# Altium schematic sheet Libaas_system.SchDoc
size A3
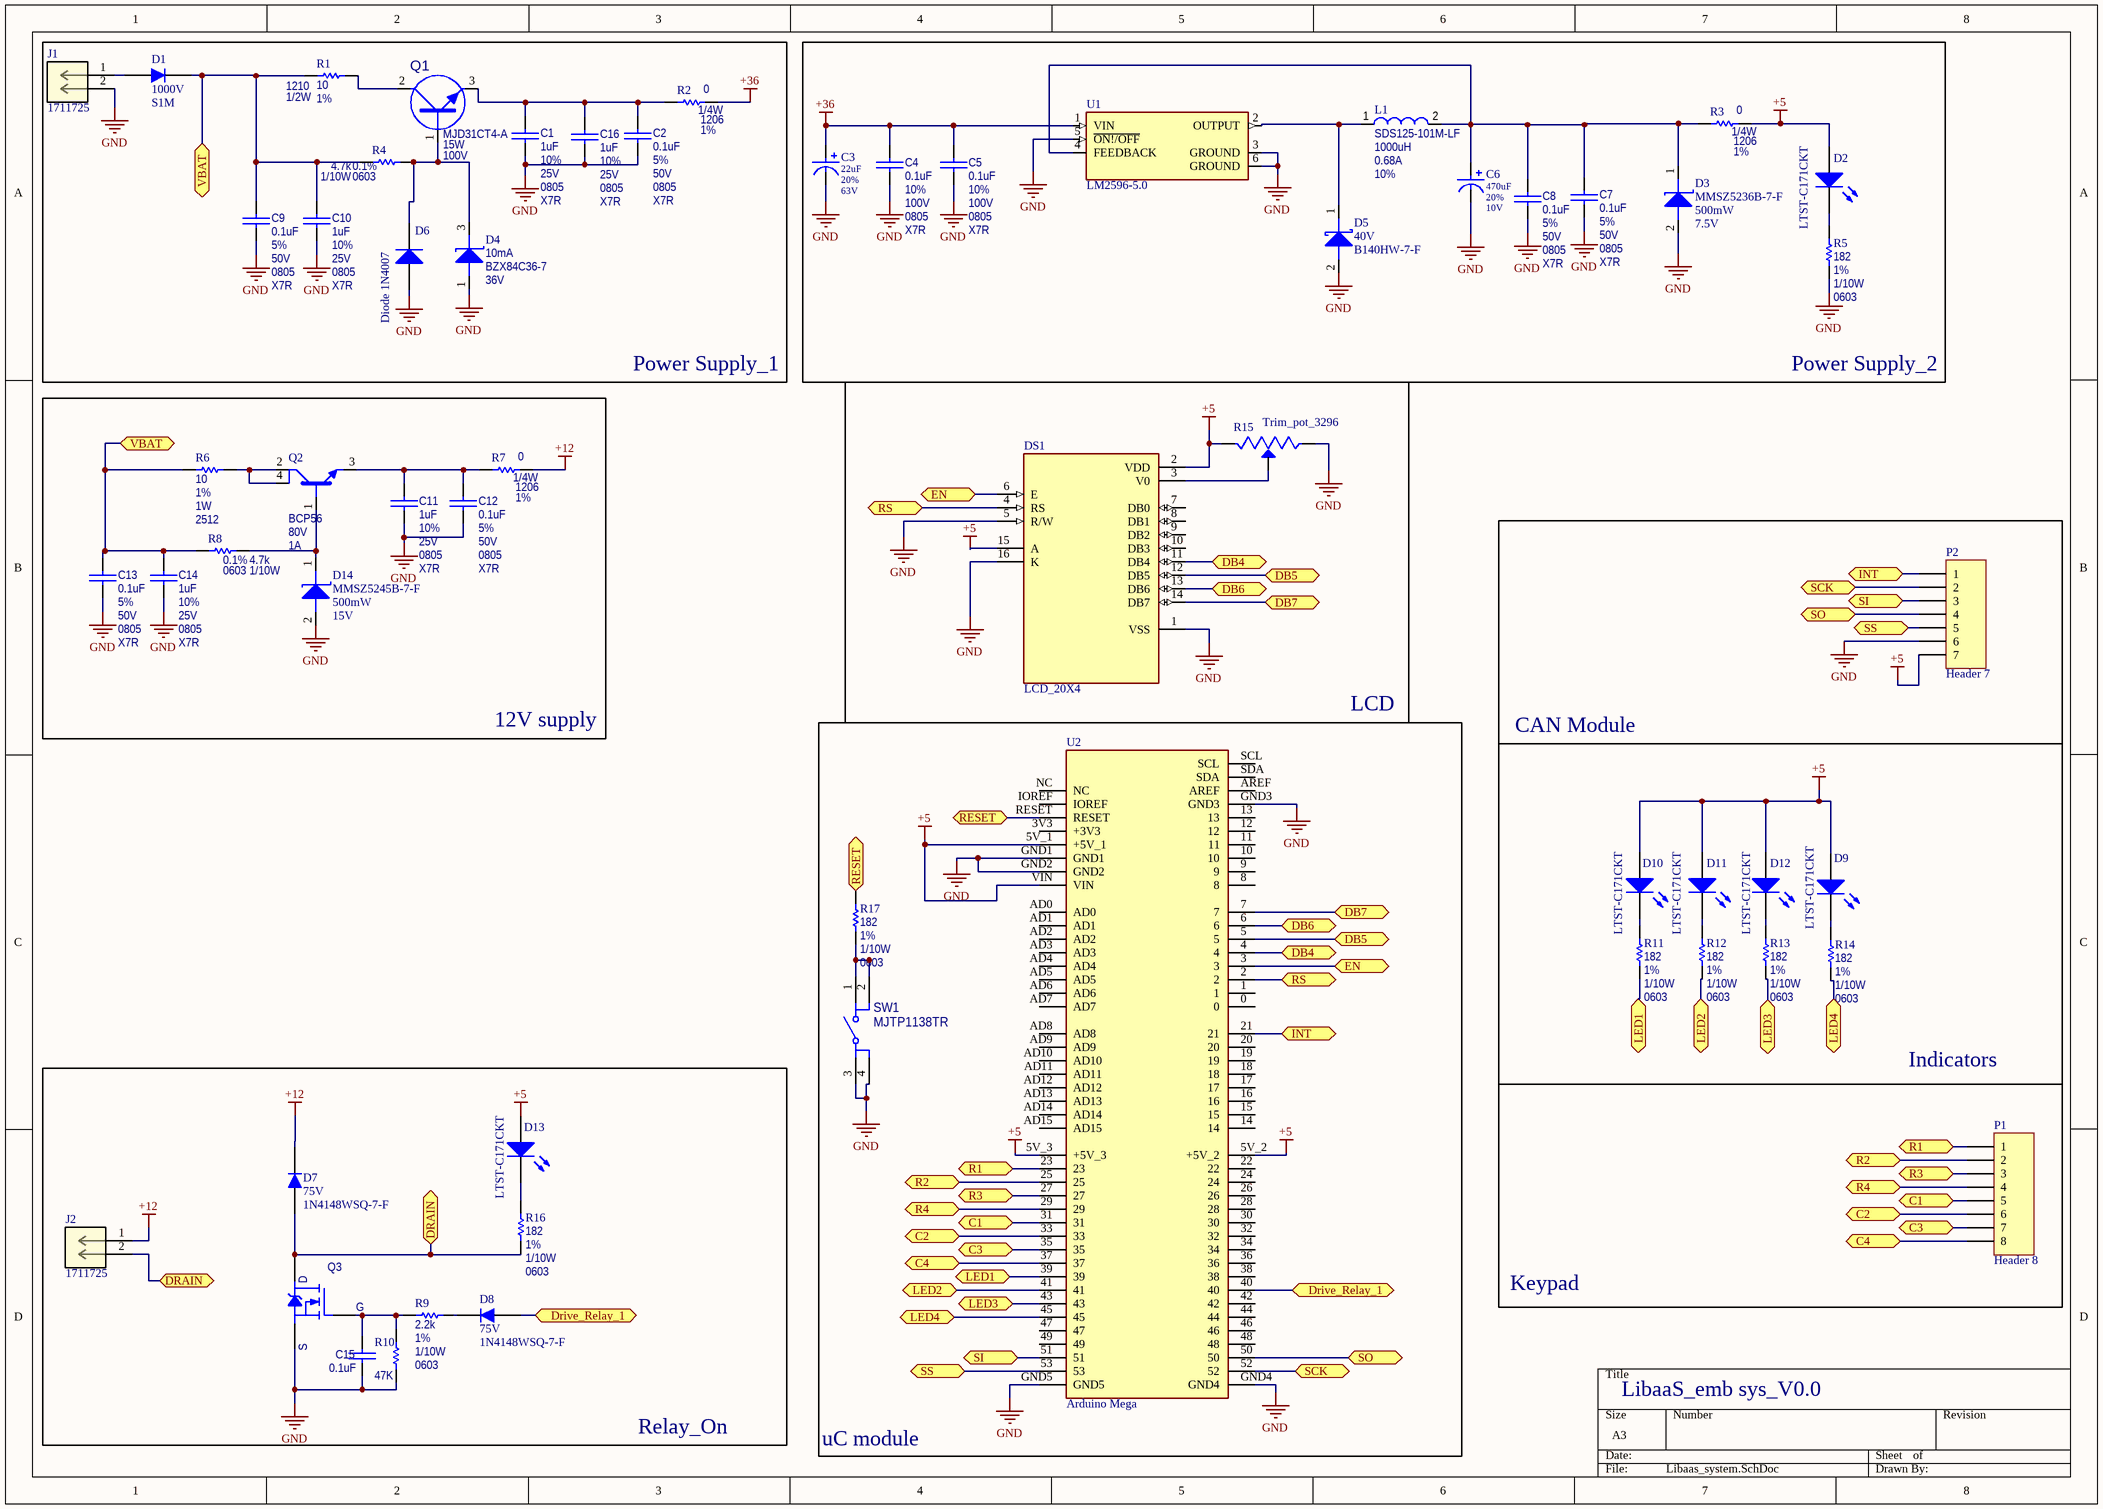
[diagram p0: Libaas_system.SchDoc]

## Parts
C1  Tolerance: 10%  Voltage: 25V  Footprint: 0805  TempCoef: X7R  [CAP0805]  (hidden comment: 1uF)
C2  Tolerance: 5%  Voltage: 50V  Footprint: 0805  TempCoef: X7R  [CAP0805]  (hidden comment: 0.1uF)
C3  Tolerance: 20%  Voltage: 63V  [CAPAE-D8_H1050]  (hidden comment: 22uF)
C4  Tolerance: 10%  Voltage: 100V  Footprint: 0805  TempCoef: X7R  [CAP0805]  (hidden comment: 0.1uF)
C5  Tolerance: 10%  Voltage: 100V  Footprint: 0805  TempCoef: X7R  [CAP0805]  (hidden comment: 0.1uF)
C6  Tolerance: 20%  Voltage: 10V  [UVZ1A471MED]  (hidden comment: 470uF)
C7  Tolerance: 5%  Voltage: 50V  Footprint: 0805  TempCoef: X7R  [CAP0805]  (hidden comment: 0.1uF)
C8  Tolerance: 5%  Voltage: 50V  Footprint: 0805  TempCoef: X7R  [CAP0805]  (hidden comment: 0.1uF)
C9  Tolerance: 5%  Voltage: 50V  Footprint: 0805  TempCoef: X7R  [CAP0805]  (hidden comment: 0.1uF)
C10  Tolerance: 10%  Voltage: 25V  Footprint: 0805  TempCoef: X7R  [CAP0805]  (hidden comment: 1uF)
C11  Tolerance: 10%  Voltage: 25V  Footprint: 0805  TempCoef: X7R  [CAP0805]  (hidden comment: 1uF)
C12  Tolerance: 5%  Voltage: 50V  Footprint: 0805  TempCoef: X7R  [CAP0805]  (hidden comment: 0.1uF)
C13  Tolerance: 5%  Voltage: 50V  Footprint: 0805  TempCoef: X7R  [CAP0805]  (hidden comment: 0.1uF)
C14  Tolerance: 10%  Voltage: 25V  Footprint: 0805  TempCoef: X7R  [CAP0805]  (hidden comment: 1uF)
C15  0.1uF  [CAP0805]
C16  Tolerance: 10%  Voltage: 25V  Footprint: 0805  TempCoef: X7R  [CAP0805]  (hidden comment: 1uF)
D1  DC Reverse Voltage  (V, Max): 1000V  Part Number: S1M  [DO-214AC]  (hidden comment: DIODE_CA)
D2  Part Number: LTST-C171CKT  [LED0805]  (hidden comment: LED)
D3  Power (W): 500mW  DC Reverse Voltage  (V, Max): 7.5V  [SOD-123]  (hidden comment: MMSZ5236B-7-F)
D4  Current at Vf (A): 10mA  Part Number: BZX84C36-7  DC Reverse Voltage  (V, Max): 36V  [SOT-23]  (hidden comment: ZENER_A_C)
D5  DC Reverse Voltage  (V, Max): 40V  Part Number: B140HW-7-F  [DO-219AD]  (hidden comment: SCHOTTKY_CA)
D6  Diode 1N4007  [DO-41]
D7  DC Reverse Voltage  (V, Max): 75V  Part Number: 1N4148WSQ-7-F  [SOD-323]  (hidden comment: DIODE_CA)
D8  DC Reverse Voltage  (V, Max): 75V  Part Number: 1N4148WSQ-7-F  [SOD-323]  (hidden comment: DIODE_CA)
D9  Part Number: LTST-C171CKT  [LED0805]  (hidden comment: LED)
D10  Part Number: LTST-C171CKT  [LED0805]  (hidden comment: LED)
D11  Part Number: LTST-C171CKT  [LED0805]  (hidden comment: LED)
D12  Part Number: LTST-C171CKT  [LED0805]  (hidden comment: LED)
D13  Part Number: LTST-C171CKT  [LED0805]  (hidden comment: LED)
D14  Power (W): 500mW  DC Reverse Voltage  (V, Max): 15V  [SOD-123]  (hidden comment: MMSZ5245B-7-F)
DS1  LCD_20X4  [HDR1X16]
J1  1711725  [1711725]
J2  1711725  [1711725]
L1  value 1000uH  Part Number: SDS125-101M-LF  Current Rating (A): 0.68A  Tolerance: 10%  [SRR1280-102K]  (hidden comment: IND)
P1  Header 8  [HDR1X8]
P2  Header 7  [HDR1X7]
Q1  Power, Max (W): 15W  Drain-Source Voltage, Vdss (V): 100V  Part Number: MJD31CT4-A  [TO-252]  (hidden comment: NPN_BCE)
Q2  Part Number: BCP56  Drain-Source Voltage, Vdss (V): 80V  Continuous Current, Id (A): 1A  [SOT-223]  (hidden comment: FZT649TA)
Q3  NMOS_GSD  [SOT-23]  (value not drawn)
R1  Tolerance: 1%  PowerRating: 1/2W  Footprint: 1210  [RES1210]  (hidden comment: 10)
R2  Tolerance: 1%  PowerRating: 1/4W  Footprint: 1206  [RES1206]  (hidden comment: 0)
R3  Tolerance: 1%  PowerRating: 1/4W  Footprint: 1206  [RES1206]  (hidden comment: 0)
R4  Tolerance: 0.1%  PowerRating: 1/10W  Footprint: 0603  [RES0603]  (hidden comment: 4.7k)
R5  Tolerance: 1%  PowerRating: 1/10W  Footprint: 0603  [RES0603]  (hidden comment: 182)
R6  Tolerance: 1%  PowerRating: 1W  Footprint: 2512  [RES2512]  (hidden comment: 10)
R7  Tolerance: 1%  PowerRating: 1/4W  Footprint: 1206  [RES1206]  (hidden comment: 0)
R8  Tolerance: 0.1%  PowerRating: 1/10W  Footprint: 0603  [RES0603]  (hidden comment: 4.7k)
R9  Tolerance: 1%  PowerRating: 1/10W  Footprint: 0603  [RES0603]  (hidden comment: 2.2k)
R10  47K  [RES0603]
R11  Tolerance: 1%  PowerRating: 1/10W  Footprint: 0603  [RES0603]  (hidden comment: 182)
R12  Tolerance: 1%  PowerRating: 1/10W  Footprint: 0603  [RES0603]  (hidden comment: 182)
R13  Tolerance: 1%  PowerRating: 1/10W  Footprint: 0603  [RES0603]  (hidden comment: 182)
R14  Tolerance: 1%  PowerRating: 1/10W  Footprint: 0603  [RES0603]  (hidden comment: 182)
R15  Trim_pot_3296  [Trim_pot_3296]
R16  Tolerance: 1%  PowerRating: 1/10W  Footprint: 0603  [RES0603]  (hidden comment: 182)
R17  Tolerance: 1%  PowerRating: 1/10W  Footprint: 0603  [RES0603]  (hidden comment: 182)
SW1  Part Number: MJTP1138TR  [KSC2XXG]  (hidden comment: KSC2-SPST-NO)
U1  LM2596-5.0  [LM2576-5.0]
U2  Arduino Mega  [Arduino Mega]

## Blocks framed on the sheet
Power Supply_1: C1 C2 C9 C10 C16 D1 D4 D6 J1 Q1 R1 R2 R4
Power Supply_2: C3-C8 D2 D3 D5 L1 R3 R5 U1
LCD: DS1 R15
12V supply: C11-C14 D14 Q2 R6-R8
CAN Module: P2
uC module: R17 SW1 U2
Indicators: D9-D12 R11-R14
Relay_On: C15 D7 D8 D13 J2 Q3 R9 R10 R16

## Ports
C1 (bidir), C2 (bidir), C3 (bidir), C4 (bidir), DB4 (bidir), DB5 (bidir), DB6 (bidir), DB7 (bidir), DRAIN (bidir), Drive_Relay_1 (bidir), EN (bidir), INT (bidir), LED1 (bidir), LED2 (bidir), LED3 (bidir), LED4 (bidir), R1 (bidir), R2 (bidir), R3 (bidir), R4 (bidir), RESET (bidir), RS (bidir), SCK (bidir), SI (bidir), SO (bidir), SS (bidir), VBAT (bidir)

## Nets
+5: D2.2(A) D9.2(A) D10.2(A) D11.2(A) D12.2(A) D13.2(A) DS1.2(VDD) DS1.15(A) P2.7 R3.2 R15.1(CCW) U2.5V_1(+5V_1) U2.5V_2(+5V_2) U2.5V_3(+5V_3) U2.VIN
+12: D7.1(C) J2.1 R7.2
+36: C3.1 C4.1 C5.1 R2.2 U1.1(VIN)
GND: C1.2 C2.2 C3.2 C4.2 C5.2 C6.2 C7.2 C8.2 C9.2 C10.2 C11.2 C12.2 C13.2 C14.2 C15.2 C16.2 D3.2(A) D4.1(A) D5.2(A) D6.1(A) D14.2(A) DS1.1(VSS) DS1.5(R/W) DS1.16(K) J1.2 P2.6 Q3.2(S) R5.2 R10.1 R15.3(CW) SW1.3 SW1.4 U1.3(GROUND) U1.5(~{ON!/OFF}) U1.6(GROUND) U2.GND1 U2.GND2 U2.GND3 U2.GND4 U2.GND5
C1: P1.5 U2.31 ; port C1
C2: P1.6 U2.33 ; port C2
C3: P1.7 U2.35 ; port C3
C4: P1.8 U2.37 ; port C4
DB4: DS1.11(DB4) U2.4 ; port DB4
DB5: DS1.12(DB5) U2.5 ; port DB5
DB6: DS1.13(DB6) U2.6 ; port DB6
DB7: DS1.14(DB7) U2.7 ; port DB7
DRAIN: D7.2(A) J2.2 Q3.3(D) R16.2 ; port DRAIN
Drive_Relay_1: D8.2(A) U2.40 ; port Drive_Relay_1
EN: DS1.6(E) U2.3 ; port EN
INT: P2.1 U2.21 ; port INT
LED1: R11.2 U2.39 ; port LED1
LED2: R12.2 U2.41 ; port LED2
LED3: R13.2 U2.43 ; port LED3
LED4: R14.2 U2.45 ; port LED4
R1: P1.1 U2.23 ; port R1
R2: P1.2 U2.25 ; port R2
R3: P1.3 U2.27 ; port R3
R4: P1.4 U2.29 ; port R4
RESET: R17.2 U2.RESET ; port RESET
RS: DS1.4(RS) U2.2 ; port RS
SCK: P2.2 U2.52 ; port SCK
SI: P2.3 U2.51 ; port SI
SO: P2.4 U2.50 ; port SO
SS: P2.5 U2.53 ; port SS
VBAT: C9.1 C10.1 C13.1 C14.1 D1.1(C) R1.1 R4.1 R6.1 R8.1 ; port VBAT
NetC1_1: C1.1 C2.1 C16.1 Q1.3(E) R2.1
NetC6_1: C6.1 C7.1 C8.1 D3.1(C) L1.2 R3.1 U1.4(FEEDBACK)
NetC11_1: C11.1 C12.1 Q2.3(E) R7.1
NetC15_1: C15.1 Q3.1(G) R9.1 R10.2
NetD1_2: D1.2(A) J1.1
NetD2_1: D2.1(K) R5.1
NetD4_3: D4.3(C) D6.2(K) Q1.1(B) R4.2
NetD5_1: D5.1(K) L1.1 U1.2(OUTPUT)
NetD8_1: D8.1(C) R9.2
NetD9_1: D9.1(K) R14.1
NetD10_1: D10.1(K) R11.1
NetD11_1: D11.1(K) R12.1
NetD12_1: D12.1(K) R13.1
NetD13_1: D13.1(K) R16.1
NetD14_1: D14.1(C) Q2.1(B) R8.2
NetDS1_3: DS1.3(V0) R15.2(WIPER)
NetQ1_2: Q1.2(C) R1.2
NetQ2_2: Q2.2(C) Q2.4(C) R6.2
NetR17_1: R17.1 SW1.1 SW1.2

Not connected (* = marked no-connect by the designer): DS1 7(DB0) 8(DB1) 9(DB2) 10(DB3); U2 0 1 3V3(+3V3) 8 9 10 11 12 13 14 15 16 17 18 19 20 22 24 26 28 30 32 34 36 38 42 44 46 47 48 49 AD0 AD1 AD2 AD3 AD4 AD5 AD6 AD7 AD8 AD9 AD10 AD11 AD12 AD13 AD14 AD15 AREF IOREF NC SCL SDA

## Notes on the sheet
- Keypad
- LibaaS_emb sys_V0.0

## Library data of the parts
C1 C10 C11 C14 C16 = C0805C105K3RACAUTO: CAP CER 1uF 25V 10% X7R 0805; Manufacturer: Kemet; Automotive Grade: AEC-Q200; Alt P/N 1: CGA6M2X7R2A105K200AA; Alt MFG 1: TDK; Alt P/N 2: HMK325B7105KNHT; Alt MFG 2: Taiyo Yuden; Value: 1uF; Part Number: C0805C105K3RACAUTO; VoltageRating: 25V; Height: 1.45mm; Mounting Type: SMD
C2 C7-C9 C12 C13 C15 = C0805C104J5RACAUTO: CAP CER 0.1uF 50V 5% X7R 0805; Manufacturer: Kemet; Automotive Grade: AEC-Q200; Alt P/N 1: CGA3E3NP02E821J080AA; Alt MFG 1: TDK; Value: 0.1uF; Part Number: C0805C104J5RACAUTO; VoltageRating: 50V; Height: 1.45mm; Mounting Type: SMD
  C15: Tolerance: 5%; Voltage: 50V; Footprint: 0805; TempCoef: X7R
C3 = EEE-TG1J220P: CAP ALUM 22uF 63V 20% SMD; Manufacturer: Panasonic; Automotive Grade: AEC-Q200; Value: 22uF; Part Number: EEE-TG1J220P; VoltageRating: 63V; Height: 10.5mm; Mounting Type: SMD
C4 C5 = C0805C104K1RACAUTO: CAP CER 0.1uF 100V 10% X7R 0805; Manufacturer: Kemet; Automotive Grade: AEC-Q200; Alt P/N 1: GCM1885C1H680FA16D; Alt MFG 1: Murata; Value: 0.1uF; Part Number: C0805C104K1RACAUTO; VoltageRating: 100V; Height: 1.45mm; Mounting Type: SMD
C6 = UVZ1A471MED: Aluminium Electrolytic Capacitors - Radial Leaded 470uF 10 Volts 20%; Manufacturer: Nichicon; Value: 470uF; Part Number: UVZ1A471MED; VoltageRating: 10V; Height: 11mm; Mounting Type: TH
D1 = S1M: DIODE GEN 1000V 1A DO214AC; Manufacturer: Vishay; Automotive Grade: AEC-Q101; Type: Standard; Forward Voltage (V): 1V; Power (W): 1W; Current at Vf (A): 1A; Height: 1.4W; Mounting Type: SMD
D2 D9-D13 = LTST-C171CKT: LED RED CLEAR 0805; Manufacturer: Lite-On; Voltage - Forward (Vf): 1.8V; Current: 20mA; Automotive Grade: N/A; Color: RED; Height: 0.8mm; Mounting Type: SMD
D3 = MMSZ5236B-7-F: Zener Diodes 7.5V 500mW SOD123; Automotive Grade: AEC-Q101; Forward Voltage (V): 900mV; Current at Vf (A): 20mA; Part Number: MMSZ5236B-7-F; Manufacturer: Diodes; Type: Zener; Height: 1.35mm; Mounting Type: SMD
D4 = BZX84C36-7: Zener Diode 36V 225mW Â±6% Surface Mount SOT-23-3 (TO-236); Manufacturer: Diodes; Forward Voltage (V): 900mV; Power (W): 500mW; Type: Zener; Height: 1.35mm; Mounting Type: SMD
D5 = B140HW-7-F: 1.0A SURFACE MOUNT SCHOTTKY BARRIER RECTIFIER; Manufacturer: Diodes; Forward Voltage (V): 500mV; Current at Vf (A): 1A; Power (W): 350mW; Type: Schottky; Height: 1.35mm; Mounting Type: SMD
D6 = Diode 1N4007: 1 Amp General Purpose Rectifier; Published: 8-Jun-2000; LatestRevisionDate: 17-Jul-2002; LatestRevisionNote: Re-released for DXP Platform.; DatasheetVersion: 1998; PackageVersion: Aug-1999; PackageReference: DO-41; Publisher: Altium Limited; PackageDescription: Diode, Axial; Body 5.2 x 2.7 mm (LxDia. max), Lead Dia. 0.86 mm (max); Code_JEDEC: DO-204-AL; ComponentLink1Description: Manufacturer Link; ComponentLink1URL: http://www.fairchildsemi.com/; ComponentLink2Description: Datasheet; ComponentLink2URL: http://www.fairchildsemi.com/ds/1N%2F1N4001.pdf
D7 D8 = 1N4148WSQ-7-F: DIODE GEN 75V 150mA SOD-323; Manufacturer: Diodes; Automotive Grade: AEC-Q101; Type: General; Forward Voltage (V): 1.25V; Power (W): 200mW; Current at Vf (A): 150mA; Height: 1.2mm; Mounting Type: SMD
D14 = MMSZ5245B-7-F: Zener Diodes 15V 500mW SOD123; Forward Voltage (V): 500mV; Current at Vf (A): 10mA; Part Number: MMSZ5245B-7-F; Manufacturer: Diodes; Type: Zener; Height: 1.35mm; Mounting Type: SMD
DS1 = LCD_20X4: 20 x 4 LCD; Manufacturer: local; MF: Gravitech; MP: LCD-20X4B; Price: None; Value: *; Availability: Unavailable; Mouser-Purchase-URL: https://snapeda.com/shop?store=Mouser&id=833821; SnapEDA_Link: https://www.snapeda.com/parts/LCD-20X4B/Gravitech/view-part/833821/?ref=snap; Package: None; Part Number: LCD_20X4; Component Type: Standard
J1 J2 = 1711725: PHOENIX CONNECTOR 5.08mm PITCH; Vendor: Phoenix Contact; Built_By: EMA_Matt; article_description: MKDS 3/ 2-5,08; Plug_system: Unknown; Producttyp: Printed circuit board terminal; Product_family: MKDS 3; pitch_(mm): 5.08; Number_of_position_per_row: 2; number_of_rows: 1; solder_pin_length_(mm): 5; SourceLibrary: Phoenix_Contact_2020-03-19; Gender: Female; No# of Positions: 3; Manufacturer_Part_Number: 1711725; Copyright: Copyright (C) 2018 Accelerated Designs. All rights reserved; contact_type: Unknown; number_of_potentials: 2; number_of_connection: 2; number_of_solder_pins_per_potentials: 1; RefDes: RefDes; Type: DEV; Part Number: 1711725; Manufacturer: PHOENIX; Mounting Type: TH
L1 = SRR1280-102K: Fixed Inductors 1000uH 10% SMD 1280; Manufacturer: Bourns; Height: 7.5mm; Mounting Type: SMD
P1 = Header 8: Header, 8-Pin; LatestRevisionDate: 17-Jul-2002; LatestRevisionNote: Re-released for DXP Platform.; Publisher: Altium Limited
P2 = Header 7: Header, 7-Pin; LatestRevisionDate: 17-Jul-2002; LatestRevisionNote: Re-released for DXP Platform.; Publisher: Altium Limited
Q1 = MJD31CT4-A: BJT NPN 100V 3A TO-252; Manufacturer: STMicro; Automotive Grade: Yes; Type: NPN; Continuous Current, Id (A): 3A; Height: 2.4mm; Mounting Type: SMD
Q2 = BCP56: 80 V, 1 A NPN medium power transistors; Manufacturer: NXP; Automotive Grade: AEC-Q101; Power, Max (W): 2W; Type: NPN; Height: 1.8mm; Mounting Type: SMD
Q3 = 2N7002KQ-7: FET N-CH 60V 380mA SOT23; Manufacturer: Diodes; Automotive Grade: AEC-Q101; Type: N-MOSFET; Rds(ON) (Ohm): 2Ohm; Power, Max (W): 370mW; Approved: Yes; Drain-Source Voltage, Vdss (V): 60V; Continuous Current, Id (A): 380mA; Part Number: 2N7002KQ-7; Height: 1.1mm; Mounting Type: SMD
R1 = CRCW121010R0FKEA: RES THK FLM 10Ohm 1% 1/2W 1210; Manufacturer: Vishay; Automotive Grade: AEC-Q200; Alt P/N 1: RMCF0603FT432K; Alt MFG 1: STACKPOLE; Alt P/N 2: AC0603FR-07432KL; Alt MFG 2: YAGEO; Value: 10; Part Number: CRCW121010R0FKEA; Height: 0.7mm; Mounting Type: SMD
R2 R3 R7 = CRCW12060000Z0EA: RES THK FLM 0Ohm 1% 1/4W 1206; Manufacturer: Vishay; Automotive Grade: AEC-Q200; Alt P/N 1: RMCF0603FT16K2; Alt MFG 1: STACKPOLE; Alt P/N 2: AC0603FR-0716K2L; Alt MFG 2: YAGEO; Value: 0; Part Number: CRCW12060000Z0EA; Height: 0.7mm; Mounting Type: SMD
R4 R8 = TNPW06034K70BEEA: RES 4.7K OHM 0.1% 1/8W 0603; Manufacturer: Vishay; Automotive Grade: AEC-Q200; Value: 4.7k; Part Number: TNPW06034K70BEEA; Height: 0.6mm; Mounting Type: SMD
R5 R11-R14 R16 R17 = CRCW0603182RFKEA: RES THK FLM 182Ohm 1% 1/10W 0603; Manufacturer: Vishay; Automotive Grade: AEC-Q200; Alt P/N 2: AC1210FR-071KL; Alt MFG 2: YAGEO; Value: 182; Part Number: CRCW0603182RFKEA; Height: 0.55mm; Mounting Type: SMD
R6 = WR25X10R0FTL: RES 10 OHM 1% 1W 2512; Manufacturer: Walsin; Value: 10; Part Number: WR25X10R0FTL; Height: 0.6mm; Mounting Type: SMD
R9 = CRCW06032K20FKEA: RES THK FLM 2.2kOhm 1% 1/10W 0603; Manufacturer: Vishay; Automotive Grade: AEC-Q200; Alt P/N 1: RMCF0603FG24K0; Alt MFG 1: STACKPOLE; Alt P/N 2: AC0603FR-0724KL; Alt MFG 2: YAGEO; Value: 2.2k; Part Number: CRCW06032K20FKEA; Height: 0.55mm; Mounting Type: SMD
R10 = CRCW060347K0FKEA: RES THK FLM 47kOhm 1% 1/10W 0603; Manufacturer: Vishay; Automotive Grade: AEC-Q200; Value: 47K; Tolerance: 1%; PowerRating: 1/10W; Footprint: 0603; Part Number: CRCW060347K0FKEA; Height: 0.55mm; Mounting Type: SMD
R15 = Trim_pot_3296: Through Hole Trimmer Potentiometer; Manufacturer: Local; MF: Bourns; MP: 3296W-1-100; Check_prices: https://www.snapeda.com/parts/3296W-1-100/Bourns/view-part/1463245/?ref=eda; Value: *; Availability: Warning; Price: None; Package: SOT-23-5 Bourns; Purchase-URL: https://pricing.snapeda.com/search/part/3296W-1-100/?ref=eda; SnapEDA_Link: https://www.snapeda.com/parts/3296W-1-100/Bourns/view-part/1463245/?ref=snap; Part Number: Trim_pot_3296; Component Type: Standard
SW1 = KSC243GLFG: SW TACT SPST-NO 32V 10mA GULLWING; Manufacturer: C&K; Automotive Grade: Yes; Mounting Type: SMD; Approved: Yes
U1 = LM2576-5.0: Switching Voltage Regulators 3A Step-Down SMPS Regulator; Manufacturer: TI; MP: LM2576-5.0WU; MF: Microchip; Value: *; SnapEDA_Link: https://www.snapeda.com/parts/LM2576-5.0WU/Microchip/view-part/104848/?ref=snap; Availability: Unavailable; Package: TO-263-5 Micrel; Price: None; Part Number: LM2576-5.0; Height: 4.57mm; Mounting Type: SMD; Category: BUCK CONV; Type: Standard
U2 = Arduino Mega Rev 3: MP: ARDUINO MEGA2560 REV3 - RETAIL; Package: None; MF: Arduino; Price: None; Availability: Unavailable; SnapEDA_Link: https://www.snapeda.com/parts/ARDUINO%20MEGA2560%20REV3%20-%20RETAIL/Arduino/view-part/1128250/?ref=snap; Value: *; Part Number: Arduino Mega Rev 3; Manufacturer: Arduino; Height: 7mm; Mounting Type: TH; Category: Controller; Type: Standard